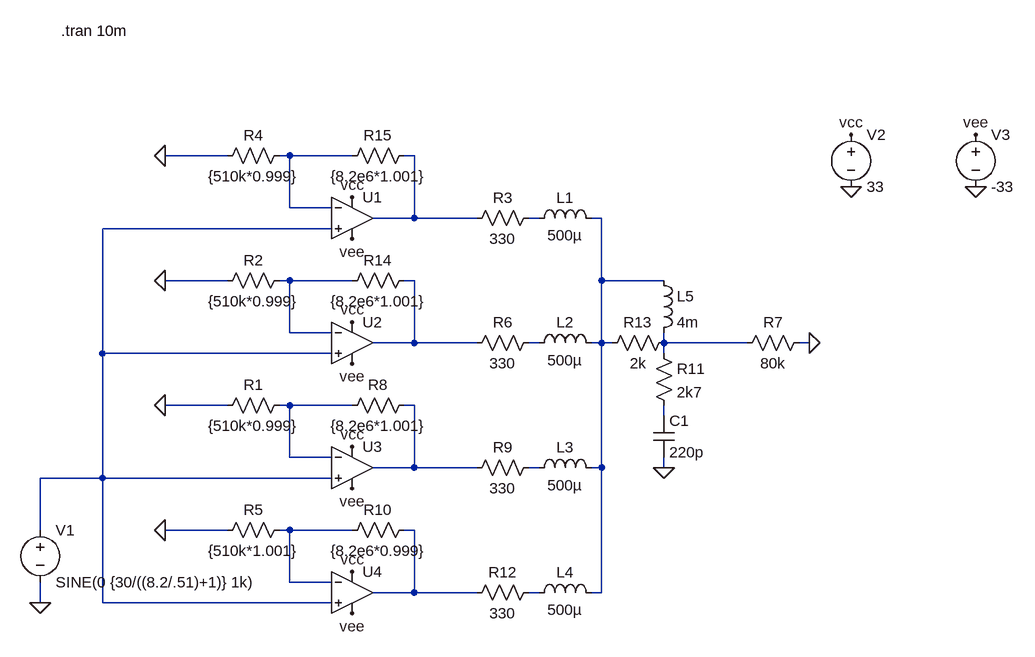
[diagram p0: schematic lm_parallel.asc]
lm_parallel.asc, the LTspice schematic file:
Version 4
SHEET 1 1244 820
WIRE 32 32 -64 32
WIRE 128 32 112 32
WIRE 224 32 128 32
WIRE 320 32 304 32
WIRE 128 112 128 32
WIRE 192 112 128 112
WIRE 320 128 320 32
WIRE 320 128 256 128
WIRE 416 128 320 128
WIRE 512 128 496 128
WIRE 608 128 592 128
WIRE 192 144 -160 144
WIRE 32 224 -64 224
WIRE 128 224 112 224
WIRE 224 224 128 224
WIRE 320 224 304 224
WIRE 608 224 608 128
WIRE 704 224 608 224
WIRE 128 304 128 224
WIRE 192 304 128 304
WIRE 320 320 320 224
WIRE 320 320 256 320
WIRE 416 320 320 320
WIRE 512 320 496 320
WIRE 608 320 608 224
WIRE 608 320 592 320
WIRE 624 320 608 320
WIRE 704 320 704 304
WIRE 832 320 704 320
WIRE 928 320 912 320
WIRE -160 336 -160 144
WIRE 192 336 -160 336
WIRE 704 336 704 320
WIRE 32 416 -64 416
WIRE 128 416 112 416
WIRE 224 416 128 416
WIRE 320 416 304 416
WIRE 704 432 704 416
WIRE 128 496 128 416
WIRE 192 496 128 496
WIRE 320 512 320 416
WIRE 320 512 256 512
WIRE 416 512 320 512
WIRE 512 512 496 512
WIRE 608 512 608 320
WIRE 608 512 592 512
WIRE 704 512 704 496
WIRE -160 528 -160 336
WIRE -160 528 -256 528
WIRE 192 528 -160 528
WIRE -256 608 -256 528
WIRE 32 608 -64 608
WIRE 128 608 112 608
WIRE 224 608 128 608
WIRE 320 608 304 608
WIRE 128 688 128 608
WIRE 192 688 128 688
WIRE 320 704 320 608
WIRE 320 704 256 704
WIRE 416 704 320 704
WIRE 512 704 496 704
WIRE 608 704 608 512
WIRE 608 704 592 704
WIRE -256 720 -256 688
WIRE -160 720 -160 528
WIRE 192 720 -160 720
FLAG -64 32 0
FLAG -64 224 0
FLAG -64 416 0
FLAG -64 608 0
FLAG -256 720 0
FLAG 224 96 vcc
FLAG 224 288 vcc
FLAG 224 480 vcc
FLAG 224 672 vcc
FLAG 224 160 vee
FLAG 224 352 vee
FLAG 224 544 vee
FLAG 224 736 vee
FLAG 928 320 0
FLAG 992 0 vcc
FLAG 992 80 0
FLAG 1184 0 vee
FLAG 1184 80 0
FLAG 704 512 0
SYMBOL Opamps\\UniversalOpamp2 224 128 R0
SYMATTR InstName U1
SYMATTR Value2 Avol=500k GBW=8Meg Slew=10Meg
SYMBOL res 400 144 R270
WINDOW 0 32 56 VTop 2
WINDOW 3 0 56 VBottom 2
SYMATTR InstName R3
SYMATTR Value 330
SYMBOL Opamps\\UniversalOpamp2 224 320 R0
SYMATTR InstName U2
SYMATTR Value2 Avol=500k GBW=8Meg Slew=10Meg
SYMBOL res 400 336 R270
WINDOW 0 32 56 VTop 2
WINDOW 3 0 56 VBottom 2
SYMATTR InstName R6
SYMATTR Value 330
SYMBOL Opamps\\UniversalOpamp2 224 512 R0
SYMATTR InstName U3
SYMATTR Value2 Avol=500k GBW=8Meg Slew=10Meg
SYMBOL res 400 528 R270
WINDOW 0 32 56 VTop 2
WINDOW 3 0 56 VBottom 2
SYMATTR InstName R9
SYMATTR Value 330
SYMBOL Opamps\\UniversalOpamp2 224 704 R0
SYMATTR InstName U4
SYMATTR Value2 Avol=500k GBW=8Meg Slew=10Meg
SYMBOL res 400 720 R270
WINDOW 0 32 56 VTop 2
WINDOW 3 0 56 VBottom 2
SYMATTR InstName R12
SYMATTR Value 330
SYMBOL voltage -256 592 R0
WINDOW 123 0 0 Left 2
WINDOW 39 0 0 Left 2
SYMATTR InstName V1
SYMATTR Value SINE(0 {30/((8.2/.51)+1)} 1k)
SYMBOL voltage 992 -16 R0
WINDOW 123 0 0 Left 2
WINDOW 39 0 0 Left 2
SYMATTR InstName V2
SYMATTR Value 33
SYMBOL voltage 1184 -16 R0
WINDOW 123 0 0 Left 2
WINDOW 39 0 0 Left 2
SYMATTR InstName V3
SYMATTR Value -33
SYMBOL res 128 592 R90
WINDOW 0 0 56 VBottom 2
WINDOW 3 32 56 VTop 2
SYMATTR InstName R5
SYMATTR Value {510k*1.001}
SYMBOL res 320 592 R90
WINDOW 0 0 56 VBottom 2
WINDOW 3 32 56 VTop 2
SYMATTR InstName R10
SYMATTR Value {8.2e6*0.999}
SYMBOL res 128 400 R90
WINDOW 0 0 56 VBottom 2
WINDOW 3 32 56 VTop 2
SYMATTR InstName R1
SYMATTR Value {510k*0.999}
SYMBOL res 128 208 R90
WINDOW 0 0 56 VBottom 2
WINDOW 3 32 56 VTop 2
SYMATTR InstName R2
SYMATTR Value {510k*0.999}
SYMBOL res 128 16 R90
WINDOW 0 0 56 VBottom 2
WINDOW 3 32 56 VTop 2
SYMATTR InstName R4
SYMATTR Value {510k*0.999}
SYMBOL res 320 400 R90
WINDOW 0 0 56 VBottom 2
WINDOW 3 32 56 VTop 2
SYMATTR InstName R8
SYMATTR Value {8.2e6*1.001}
SYMBOL res 320 208 R90
WINDOW 0 0 56 VBottom 2
WINDOW 3 32 56 VTop 2
SYMATTR InstName R14
SYMATTR Value {8.2e6*1.001}
SYMBOL res 320 16 R90
WINDOW 0 0 56 VBottom 2
WINDOW 3 32 56 VTop 2
SYMATTR InstName R15
SYMATTR Value {8.2e6*1.001}
SYMBOL ind 496 144 R270
WINDOW 0 32 56 VTop 2
WINDOW 3 5 56 VBottom 2
SYMATTR InstName L1
SYMATTR Value 500µ
SYMATTR SpiceLine Rser=5
SYMBOL ind 496 336 R270
WINDOW 0 32 56 VTop 2
WINDOW 3 5 56 VBottom 2
SYMATTR InstName L2
SYMATTR Value 500µ
SYMATTR SpiceLine Rser=5
SYMBOL ind 496 528 R270
WINDOW 0 32 56 VTop 2
WINDOW 3 5 56 VBottom 2
SYMATTR InstName L3
SYMATTR Value 500µ
SYMATTR SpiceLine Rser=5
SYMBOL ind 496 720 R270
WINDOW 0 32 56 VTop 2
WINDOW 3 5 56 VBottom 2
SYMATTR InstName L4
SYMATTR Value 500µ
SYMATTR SpiceLine Rser=5
SYMBOL res 928 304 R90
WINDOW 0 0 56 VBottom 2
WINDOW 3 32 56 VTop 2
SYMATTR InstName R7
SYMATTR Value 80k
SYMBOL res 688 320 R0
SYMATTR InstName R11
SYMATTR Value 2k7
SYMBOL cap 688 432 R0
SYMATTR InstName C1
SYMATTR Value 220p
SYMBOL ind 688 208 R0
SYMATTR InstName L5
SYMATTR Value 4m
SYMATTR SpiceLine Rser=5
SYMBOL res 720 304 R90
WINDOW 0 0 56 VBottom 2
WINDOW 3 32 56 VTop 2
SYMATTR InstName R13
SYMATTR Value 2k
TEXT -224 -160 Left 2 !.tran 10m

The netlist it stands for:
* lm_parallel.asc
XU1 N005 N001 vcc vee N002 level.2 Avol=500k GBW=8Meg Slew=10Meg ilimit=25m rail=0 Vos=0 phimargin=45 en=0 enk=0 in=0 ink=0 Rin=500Meg  ; pins IN+ IN- V+ V- OUT
R3 N002 N003 330
XU2 N005 N006 vcc vee N007 level.2 Avol=500k GBW=8Meg Slew=10Meg ilimit=25m rail=0 Vos=0 phimargin=45 en=0 enk=0 in=0 ink=0 Rin=500Meg  ; pins IN+ IN- V+ V- OUT
R6 N007 N008 330
XU3 N005 N010 vcc vee N011 level.2 Avol=500k GBW=8Meg Slew=10Meg ilimit=25m rail=0 Vos=0 phimargin=45 en=0 enk=0 in=0 ink=0 Rin=500Meg  ; pins IN+ IN- V+ V- OUT
R9 N011 N013 330
XU4 N005 N014 vcc vee N015 level.2 Avol=500k GBW=8Meg Slew=10Meg ilimit=25m rail=0 Vos=0 phimargin=45 en=0 enk=0 in=0 ink=0 Rin=500Meg  ; pins IN+ IN- V+ V- OUT
R12 N015 N016 330
V1 N005 0 SINE(0 {30/((8.2/.51)+1)} 1k)
V2 vcc 0 33
V3 vee 0 -33
R5 N014 0 {510k*1.001}
R10 N015 N014 {8.2e6*0.999}
R1 N010 0 {510k*0.999}
R2 N006 0 {510k*0.999}
R4 N001 0 {510k*0.999}
R8 N011 N010 {8.2e6*1.001}
R14 N007 N006 {8.2e6*1.001}
R15 N002 N001 {8.2e6*1.001}
L1 N003 N004 500µ Rser=5
L2 N008 N004 500µ Rser=5
L3 N013 N004 500µ Rser=5
L4 N016 N004 500µ Rser=5
R7 0 N009 80k
R11 N009 N012 2k7
C1 N012 0 220p
L5 N004 N009 4m Rser=5
R13 N009 N004 2k
.tran 10m
.lib UniversalOpamps2.sub
.backanno
.end